# Altium schematic sheet DiPho_main.SchDoc
size A4
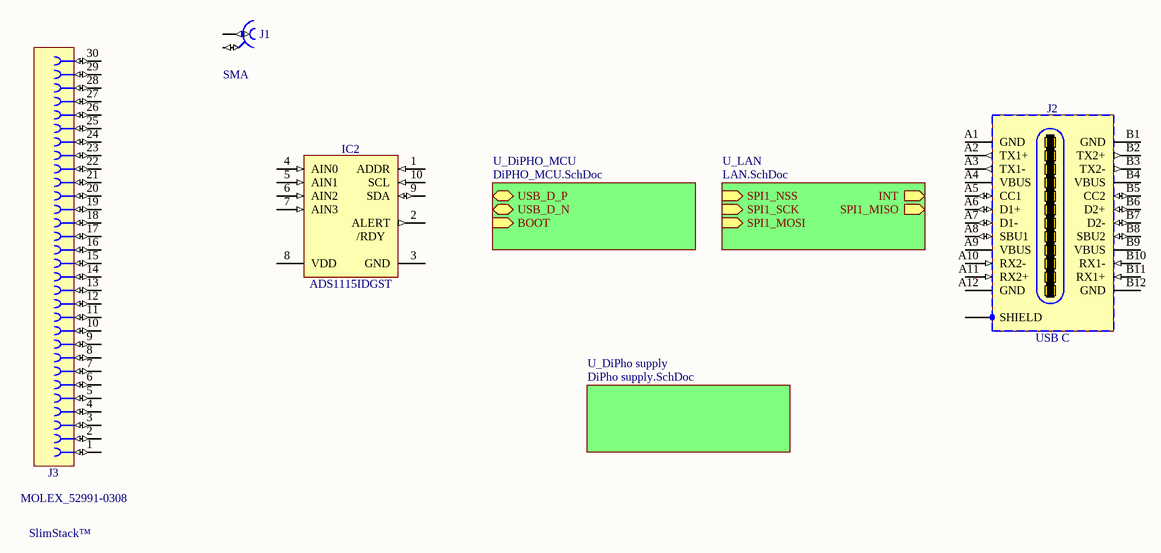
[diagram p0: DiPho_main.SchDoc]

## Parts
IC2  ADS1115IDGST  [SOP50P490X110-10N]
J1  SMA  [AMPHENOL_132134]
J2  USB C  [AMPHENOL_10132328-10011LF]
J3  SlimStack™  [MOLEX_52991-0308]

## Sub-sheets
U_DiPho supply = DiPho supply.SchDoc: no entries
U_DiPHO_MCU = DiPHO_MCU.SchDoc: USB_D_P (bidir), USB_D_N (bidir), BOOT (in)
U_LAN = LAN.SchDoc: INT (out), SPI1_NSS (in), SPI1_SCK (in), SPI1_MOSI (in), SPI1_MISO (out)

## Nets

Not connected (* = marked no-connect by the designer): IC2 1(ADDR) 2(ALERT) 3(GND) 4(AIN0) 5(AIN1) 6(AIN2) 7(AIN3) 8(VDD) 9(SDA) 10(SCL); J1 1 2; J2 A1(GND) A2(TX1+) A3(TX1-) A4(VBUS) A5(CC1) A6(D1+) A7(D1-) A8(SBU1) A9(VBUS) A10(RX2-) A11(RX2+) A12(GND) B1(GND) B2(TX2+) B3(TX2-) B4(VBUS) B5(CC2) B6(D2+) B7(D2-) B8(SBU2) B9(VBUS) B10(RX1-) B11(RX1+) B12(GND) SHIELD; J3 1 2 3 4 5 6 7 8 9 10 11 12 13 14 15 16 17 18 19 20 21 22 23 24 25 26 27 28 29 30

## Notes on the sheet
- (in symbol ADS1115IDGST) /RDY

## Library data of the parts
IC2 = ADS1115IDGST: Ultra-Small, Low-Power, 16-Bit Analog-to-Digital Converter with Internal Reference; Part Description: Ultra-Small, Low-Power, 4 Channels 16-Bit Analog-to-Digital Converter with Internal Reference; Manufacturer: TEXAS INSTRUMENTS; PressFit: No; Bonding: No; Part Number: ADS1115IDGST; Component Kind: Standard; Component Type: Standard; Device: ADS1115IDGST; PackageDescription: SOP, 0.50mm Pitch; 10 Pin, 3.00mm W X 3.00mm L X 1.10mm H body, IPC Medium Density; Manufacturer Part Number: ADS1115IDGST; Pin Count: 10; Case: MSOP10; Mounted: Yes; Socket: No; SMD: Yes; Sense: No; ComponentHeight: 1.1mm; Author: CERN DEM JLC; HelpURL: \\cern.ch\dfs\Applications\Altium\Datasheets\ADS1115IDGST.pdf; CreateDate: 29.10.2012; LatestRevisionDate: 29.10.2012
J1 = AMPHENOL_132134: Part Description: 50 Ohm Through Hole SMA Straight PCB Jack; Manufacturer Part Number: 132134; PressFit: No; Part Number: AMPHENOL_132134; Component Kind: Standard; Component Type: Standard; Pin Count: 4; Family: SMA; Mounted: Yes; Socket: No; SMD: No; Sense: No; Status: None; Manufacturer: AMPHENOL; ComponentHeight: 9.53mm; HelpURL: \\cern.ch\dfs\Applications\Altium\Datasheets\AMPHENOL_132134.pdf; Author: CERN DEM JLC; CreateDate: 16.12.2013; LatestRevisionDate: 16.12.2013
J2 = AMPHENOL_10132328-10011LF: 2x12 Pin + 1 Shield  USB Type C Receptacle; Part Description: 1 Port Vertical Receptacle 24 Contacts, USB Type C Input Output Connector; PressFit: No; Part Number: AMPHENOL_10132328-10011LF; Component Kind: Standard; Component Type: Standard; Pin Count: 34; Family: USB C; Mounted: Yes; Socket: No; SMD: Yes; Sense: No; Status: None; Manufacturer: AMPHENOL; Manufacturer Part Number: 10132328-10011LF; ComponentHeight: 8.8mm; HelpURL: \\cern.ch\dfs\Applications\Altium\Datasheets\AMPHENOL_10132328-10011LF.pdf; Author: CERN DEM BC; CreateDate: 23.10.2020; LatestRevisionDate: 23.10.2020
J3 = MOLEX_52991-0308: Connector 30 Female; Part Description: 0.50mm Pitch SlimStack™ Dual Row 30 Circuits Surface Mount Vertical Receptacle (3.00 and 4.00mm Stacking Heights); Manufacturer: MOLEX; PressFit: No; Part Number: MOLEX_52991-0308; Component Kind: Standard; Component Type: Standard; Pin Count: 30; Family: SlimStack™; Mounted: Yes; Socket: No; SMD: Yes; Sense: No; Status: None; Manufacturer Part Number: 52991-0308; ComponentHeight: 2.27mm; HelpURL: \\cern.ch\dfs\Applications\Altium\Datasheets\MOLEX_52991-0308.pdf; Author: CERN DEM JLC; CreateDate: 28.08.2012; LatestRevisionDate: 28.08.2012